# Altium project vs1003.PrjPCB
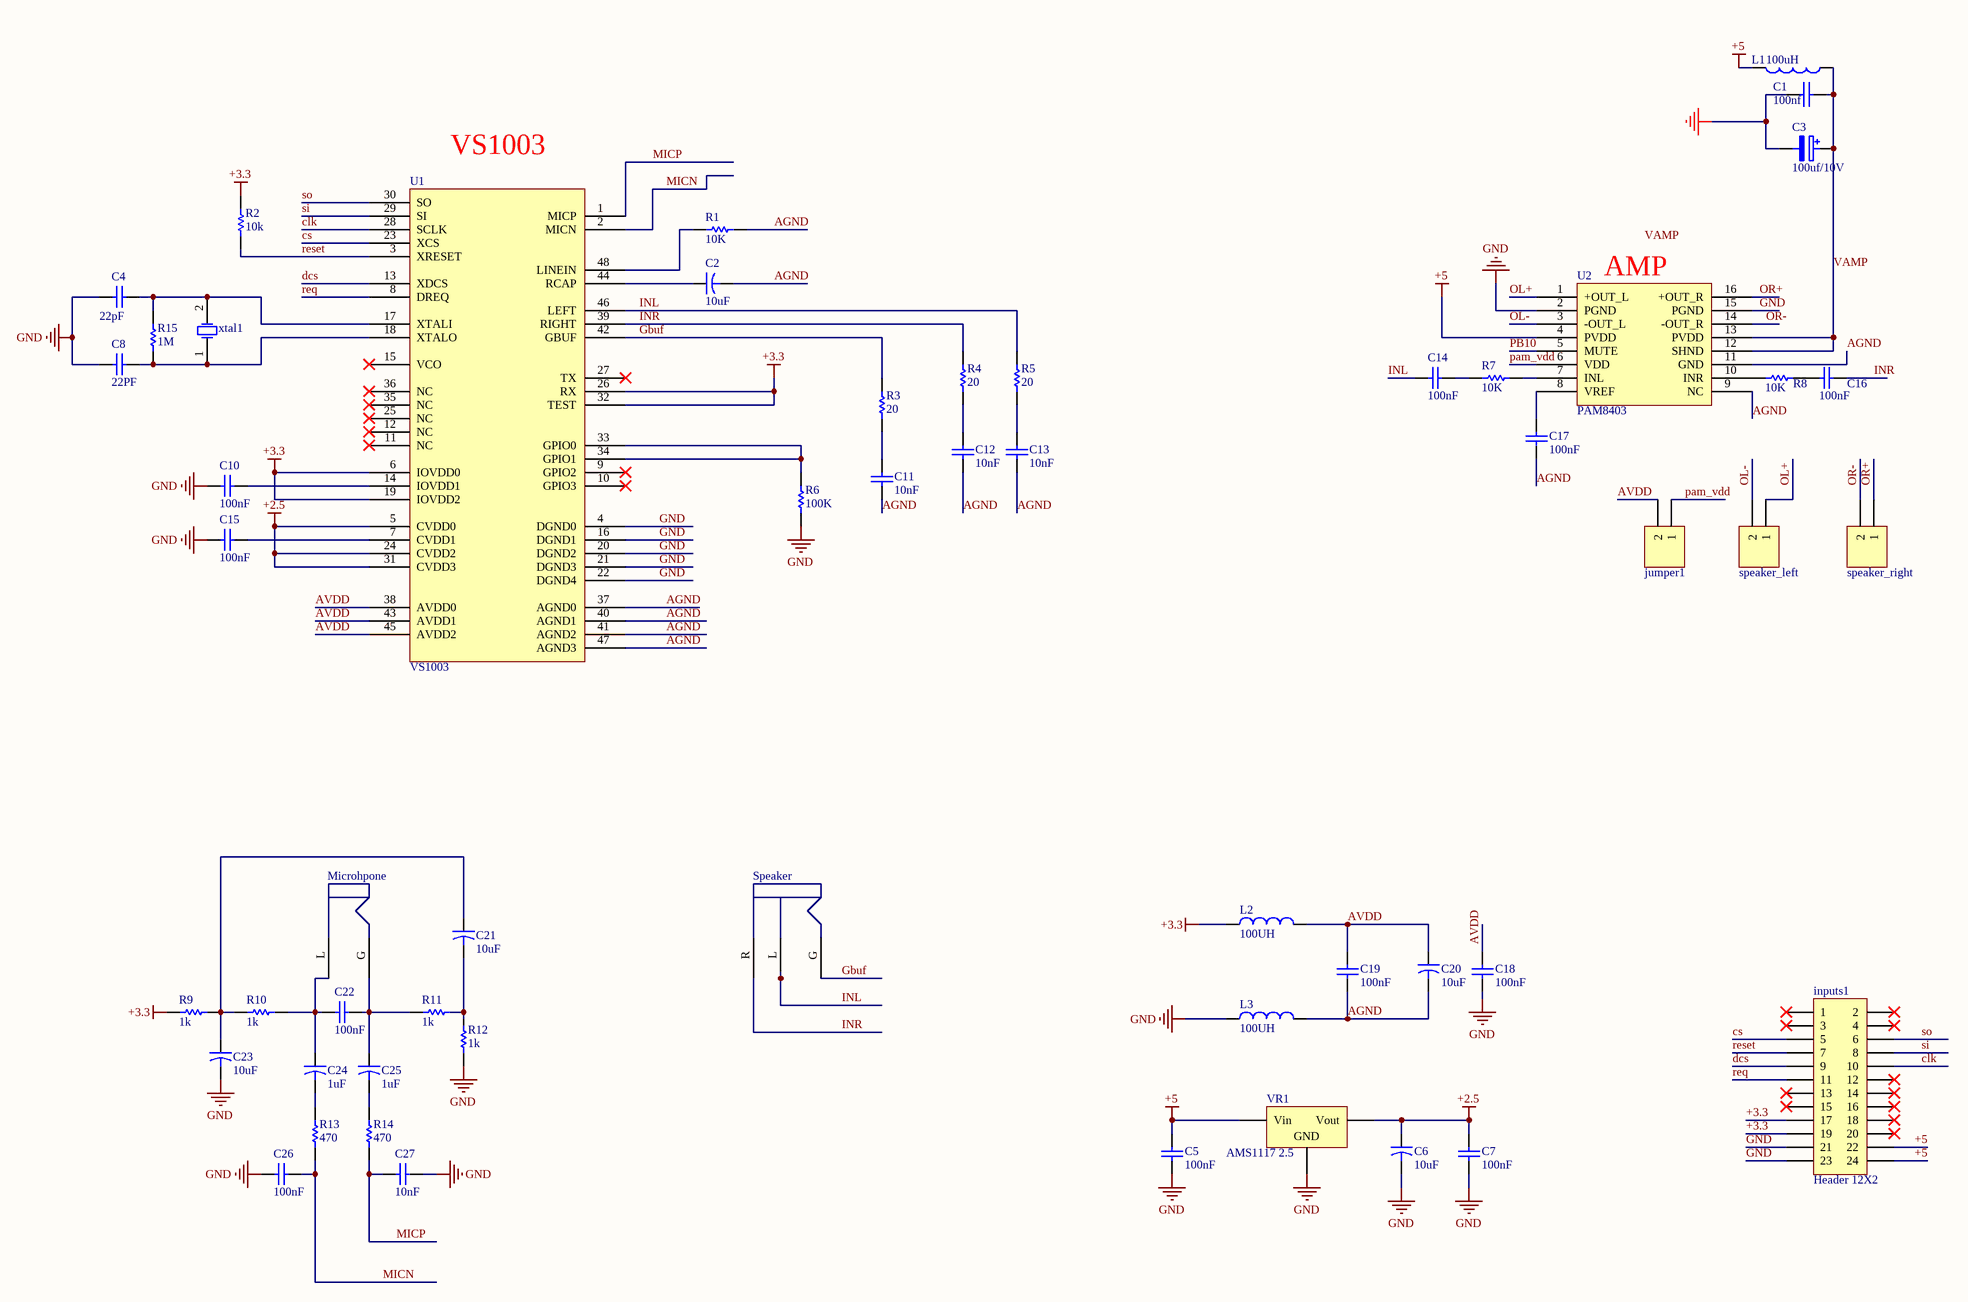
[diagram p0: vs1003.SchDoc]
1 sheet, 54 parts. Net scope: global (net labels, ports and power ports of the same name join across sheets).
Board file: vs1003.PcbDoc

## Sheet vs1003.SchDoc
size C

### Parts
C1  100nf  [1206]
C2  10uF  [1206]
C3  100uf/10V  [SMD -D]
C4  value 22pF  [1206]  (hidden comment: Cap)
C5  100nF  [1206]
C6  10uF  [1206]
C7  100nF  [1206]
C8  22PF  [1206]
C10  100nF  [1206]
C11  10nF  [1206]
C12  10nF  [1206]
C13  10nF  [1206]
C14  100nF  [1206]
C15  100nF  [1206]
C16  100nF  [1206]
C17  100nF  [1206]
C18  100nF  [1206]
C19  100nF  [1206]
C20  10uF  [1206]
C21  10uF  [1206]
C22  100nF  [1206]
C23  10uF  [1206]
C24  1uF  [1206]
C25  1uF  [1206]
C26  100nF  [1206]
C27  10nF  [1206]
inputs1  Header 12X2  [HDR2X12]
jumper1  Header 2  [HDR1X2]  (value not drawn)
L1  100uH  [1206]
L2  100UH  [1206]
L3  100UH  [1206]
Microhpone  Microhpone  [SPEAKER]  (value not drawn)
R1  10K  [1206]
R2  10k  [1206]
R3  20  [1206]
R4  20  [1206]
R5  20  [1206]
R6  100K  [1206]
R7  10K  [1206]
R8  10K  [1206]
R9  1k  [1206]
R10  1k  [1206]
R11  1k  [1206]
R12  1k  [1206]
R13  470  [1206]
R14  470  [1206]
R15  1M  [1206]
Speaker  Stereo Speaker  [SPEAKER]  (value not drawn)
speaker_left  Header 2  [HDR1X2]  (value not drawn)
speaker_right  Header 5  [HDR1X2]  (value not drawn)
U1  VS1003  [TQFP48_M2]
U2  PAM8403  [751B-05_N]
VR1  AMS1117 2.5  [Regolator]
xtal1  XTAL  [XTAL3]  (value not drawn)

### Nets
+2.5: C6.1 C7.2 U1.5(CVDD0) U1.24(CVDD2) U1.31(CVDD3) VR1.3(Vout)
+3.3: inputs1.17 inputs1.19 L2.1 R2.1 R9.1 U1.6(IOVDD0) U1.19(IOVDD2) U1.26(RX) U1.32(TEST)
+5: C5.2 inputs1.22 inputs1.24 L1.1 U2.4(PVDD) VR1.1(Vin)
GND: C1.2 C3.2 C4.1 C5.1 C6.2 C7.1 C8.1 C10.2 C15.2 C18.2 C23.2 C26.1 C27.2 inputs1.21 inputs1.23 L3.1 R6.1 R12.2 U1.4(DGND0) U1.16(DGND1) U1.20(DGND2) U1.21(DGND3) U1.22(DGND4) U2.2(PGND) U2.15(PGND) VR1.2(GND)
AGND: C2.2 C11.2 C12.2 C13.2 C17.1 C19.2 C20.2 L3.2 R1.1 U1.37(AGND0) U1.40(AGND1) U1.41(AGND2) U1.47(AGND3) U2.9(NC) U2.11(GND)
AVDD: C18.1 C19.1 C20.1 jumper1.2 L2.2 U1.38(AVDD0) U1.43(AVDD1) U1.45(AVDD2)
clk: inputs1.10 U1.28(SCLK)
cs: inputs1.5 U1.23(XCS)
dcs: inputs1.9 U1.13(XDCS)
Gbuf: R3.2 Speaker.G U1.42(GBUF)
INL: C14.1 R5.1 Speaker.L U1.46(LEFT)
INR: C16.2 R4.1 Speaker.R U1.39(RIGHT)
MICN: C26.2 R13.1 U1.2(MICN)
MICP: C27.1 R14.1 U1.1(MICP)
OL+: speaker_left.1 U2.1(+OUT_L)
OL-: speaker_left.2 U2.3(-OUT_L)
OR+: speaker_right.1 U2.16(+OUT_R)
OR-: speaker_right.2 U2.14(-OUT_R)
pam_vdd: jumper1.1 U2.6(VDD)
PB10: U2.5(MUTE)
req: inputs1.11 U1.8(DREQ)
reset: inputs1.7 R2.2 U1.3(XRESET)
si: inputs1.8 U1.29(SI)
so: inputs1.6 U1.30(SO)
VAMP: C1.1 C3.1 L1.2 U2.12(SHND) U2.13(PVDD)
NetC2_1: C2.1 U1.44(RCAP)
NetC4_2: C4.2 R15.1 U1.17(XTALI) xtal1.2(OSC2)
NetC8_2: C8.2 R15.2 U1.18(XTALO) xtal1.1(OSC1)
NetC10_1: C10.1 U1.14(IOVDD1)
NetC11_1: C11.1 R3.1
NetC12_1: C12.1 R4.2
NetC13_1: C13.1 R5.2
NetC14_2: C14.2 R7.2
NetC15_1: C15.1 U1.7(CVDD1)
NetC16_1: C16.1 R8.1
NetC17_2: C17.2 U2.8(VREF)
NetC21_1: C21.1 C23.1 R9.2 R10.1
NetC21_2: C21.2 R11.2 R12.1
NetC22_1: C22.1 C24.1 Microhpone.L R10.2
NetC22_2: C22.2 C25.1 Microhpone.G(L) R11.1
NetC24_2: C24.2 R13.2
NetC25_2: C25.2 R14.2
NetR1_2: R1.2 U1.48(LINEIN)
NetR6_2: R6.2 U1.33(GPIO0) U1.34(GPIO1)
NetR7_1: R7.1 U2.7(INL)
NetR8_2: R8.2 U2.10(INR)

Not connected (* = marked no-connect by the designer): inputs1 1* 2* 3* 4* 12* 13* 14* 15* 16* 18* 20*; U1 9(GPIO2)* 10(GPIO3)* 11(NC)* 12(NC)* 15(VCO)* 25(NC)* 27(TX)* 35(NC)* 36(NC)*

### Notes on the sheet
- (near U1) VS1003
- (near U2) AMP
- Labels drawn without touching a wire or pin: VAMP

### Library data of the parts
C1 = CAP
C2 C6 C20 C21 C23-C25 = Cap2: Capacitor; Value: 100pF; Published: 23-Sep-2002; PackageReference: CAPR5-4X5; Publisher: Altium Limited; PackageDescription: Capacitor; 2 Leads
C3 = ELECTRO2: Electrolytic Capacitor
C4 = Cap: Capacitor; Published: 8-Jun-2000; LatestRevisionDate: 17-Jul-2002; LatestRevisionNote: Re-released for DXP Platform.; PackageReference: RAD-0.3; Publisher: Altium Limited; PackageDescription: Radial Cap, Thru-Hole; 2 Leads; 0.3 in Pin Spacing
C5 C7 C10-C19 C22 C26 C27 = Cap Semi: Capacitor (Semiconductor SIM Model); Value: 100pF; Published: 8-Jun-2000; LatestRevisionDate: 29-May-2009; LatestRevisionNote: IPC-7351 Footprint Added.; PackageReference: C1206; Publisher: Altium Limited; PackageDescription: Chip Capacitor
C8 = Cap: Capacitor; Value: 100pF; Published: 8-Jun-2000; LatestRevisionDate: 17-Jul-2002; LatestRevisionNote: Re-released for DXP Platform.; PackageReference: RAD-0.3; Publisher: Altium Limited; PackageDescription: Radial Cap, Thru-Hole; 2 Leads; 0.3 in Pin Spacing
inputs1 = Header 12X2: Header, 12-Pin, Dual row; LatestRevisionDate: 17-Jul-2002; LatestRevisionNote: Re-released for DXP Platform.; Publisher: Altium Limited
jumper1 speaker_left speaker_right = Header 2: Header, 2-Pin; LatestRevisionDate: 17-Jul-2002; LatestRevisionNote: Re-released for DXP Platform.; Publisher: Altium Limited
L1 = INDUCTOR1
L2 L3 = Inductor: Code_IEC: 1005; Value: 10mH; Published: 8-Jun-2000; LatestRevisionDate: 29-May-2009; LatestRevisionNote: IPC-7351 Footprint Added.; PackageReference: 0402-A; Publisher: Altium Limited; PackageDescription: Chip Inductor; Code_JEITA: 0402
Microhpone = myPhoneJack
R1-R8 R13-R15 = Res Semi: Semiconductor Resistor; Value: 1K; Published: 8-Jun-2000; LatestRevisionDate: 17-Jul-2002; LatestRevisionNote: Re-released for DXP Platform.; PackageReference: AXIAL-0.5; Publisher: Altium Limited; PackageDescription: Axial Device, Thru-Hole; 2 Leads; 0.5 in Pin Spacing
R9-R12 = Res Semi: Semiconductor Resistor; Published: 8-Jun-2000; LatestRevisionDate: 17-Jul-2002; LatestRevisionNote: Re-released for DXP Platform.; PackageReference: AXIAL-0.5; Publisher: Altium Limited; PackageDescription: Axial Device, Thru-Hole; 2 Leads; 0.5 in Pin Spacing; Value: 1K
VR1 = Volt Reg: Voltage Regulator; Published: 24-Mar-1999; LatestRevisionDate: 29-May-2009; LatestRevisionNote: IPC-7351 Footprint Added.; PackageReference: D2PAK; Publisher: Altium Limited; PackageDescription: 3-Pin Transistor Outline Package 2.54 mm Pitch, 15.1 mm Lead Span
xtal1 = XTAL: Crystal Oscillator; Published: 8-Jun-2000; LatestRevisionDate: 17-Jul-2002; LatestRevisionNote: Re-released for DXP Platform.; PackageReference: R38; Publisher: Altium Limited; PackageDescription: Crystal, Thru-Hole; 2 Leads; Body 3.1 x 8.2 mm (Dia.xH)